# Altium schematic sheet PROB_S7CAS_INTERFACE.SchDoc
size Tabloid; SheetNumber: 8; SheetTotal: 15; Sheet_Name: Interface Utilisateur FPGA; Size: 11x17
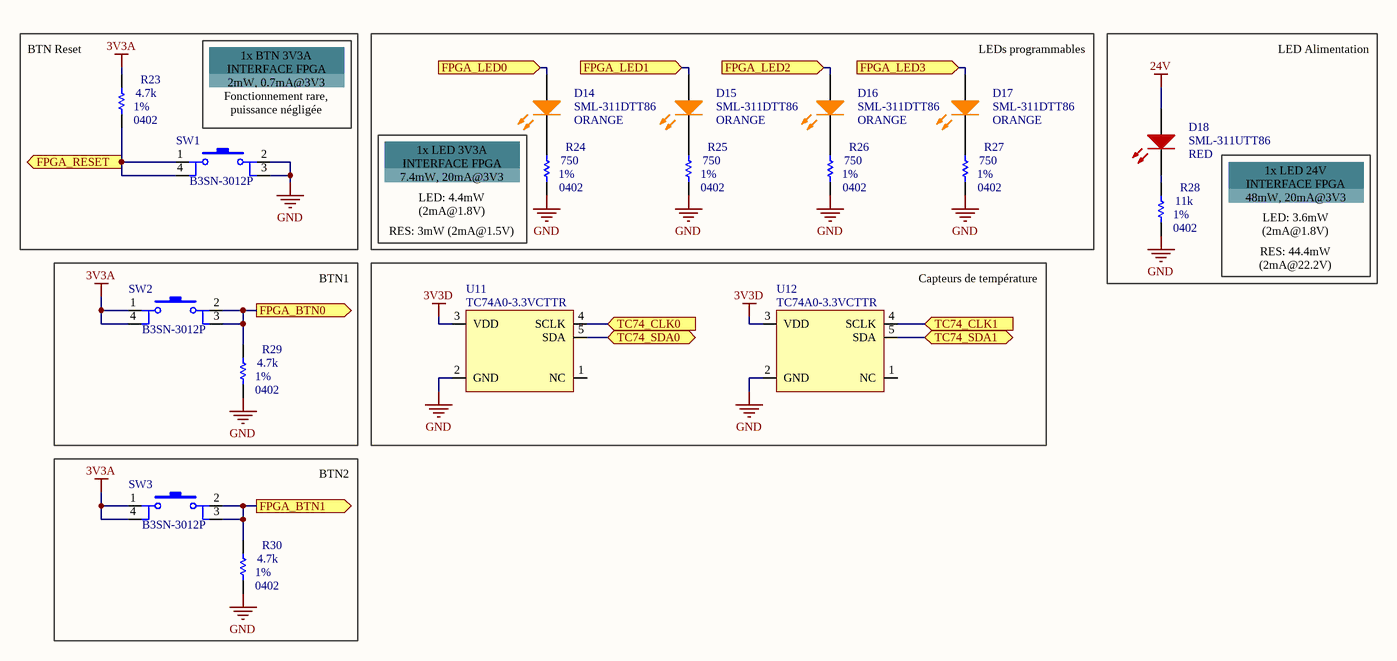
[diagram p0: PROB_S7CAS_INTERFACE.SchDoc]

## Parts
D14  SML-311DTT86  value ORANGE  [LED_0603]
D15  SML-311DTT86  value ORANGE  [LED_0603]
D16  SML-311DTT86  value ORANGE  [LED_0603]
D17  SML-311DTT86  value ORANGE  [LED_0603]
D18  SML-311UTT86  value RED  [LED_0603]
R23  value 4.7k  Package: 0402  Precision: 1%  [RES_0402]  (hidden comment: RES - 0402)
R24  value 750  Package: 0402  Precision: 1%  [RES_0402]  (hidden comment: RES - 0402)
R25  value 750  Package: 0402  Precision: 1%  [RES_0402]  (hidden comment: RES - 0402)
R26  value 750  Package: 0402  Precision: 1%  [RES_0402]  (hidden comment: RES - 0402)
R27  value 750  Package: 0402  Precision: 1%  [RES_0402]  (hidden comment: RES - 0402)
R28  value 11k  Package: 0402  Precision: 1%  [RES_0402]  (hidden comment: RES - 0402)
R29  value 4.7k  Package: 0402  Precision: 1%  [RES_0402]  (hidden comment: RES - 0402)
R30  value 4.7k  Package: 0402  Precision: 1%  [RES_0402]  (hidden comment: RES - 0402)
SW1  B3SN-3012P  [SWI_TACT_B3SN-3012P]
SW2  B3SN-3012P  [SWI_TACT_B3SN-3012P]
SW3  B3SN-3012P  [SWI_TACT_B3SN-3012P]
U11  TC74A0-3.3VCTTR  [SEN_TEMP_TC74A0-3.3VCTTR]
U12  TC74A0-3.3VCTTR  [SEN_TEMP_TC74A0-3.3VCTTR]

## Ports
FPGA_BTN0 (out), FPGA_BTN1 (out), FPGA_LED0 (in), FPGA_LED1 (in), FPGA_LED2 (in), FPGA_LED3 (in), FPGA_RESET (out), TC74_CLK0 (in), TC74_CLK1 (in), TC74_SDA0 (bidir), TC74_SDA1 (bidir)

## Nets
3V3A: R23.2 SW2.1 SW2.4 SW3.1 SW3.4
3V3D: U11.3(VDD) U12.3(VDD)
24V: D18.A
GND: R24.1 R25.1 R26.1 R27.1 R28.1 R29.1 R30.1 SW1.2 SW1.3 U11.2(GND) U12.2(GND)
FPGA_BTN0: R29.2 SW2.2 SW2.3 ; port FPGA_BTN0
FPGA_BTN1: R30.2 SW3.2 SW3.3 ; port FPGA_BTN1
FPGA_LED0: D14.A ; port FPGA_LED0
FPGA_LED1: D15.A ; port FPGA_LED1
FPGA_LED2: D16.A ; port FPGA_LED2
FPGA_LED3: D17.A ; port FPGA_LED3
FPGA_RESET: R23.1 SW1.1 SW1.4 ; port FPGA_RESET
TC74_CLK0: U11.4(SCLK) ; port TC74_CLK0
TC74_CLK1: U12.4(SCLK) ; port TC74_CLK1
TC74_SDA0: U11.5(SDA) ; port TC74_SDA0
TC74_SDA1: U12.5(SDA) ; port TC74_SDA1
NetD14_K: D14.K R24.2
NetD15_K: D15.K R25.2
NetD16_K: D16.K R26.2
NetD17_K: D17.K R27.2
NetD18_K: D18.K R28.2

Not connected (* = marked no-connect by the designer): U11 1(NC); U12 1(NC)

## Notes on the sheet
- (near R23) BTN Reset
- 1x BTN 3V3A
- INTERFACE FPGA
- 2mW, 0.7mA@3V3
- (near D17) LEDs programmables
- LED Alimentation
- (near SW1) Fonctionnement rare, puissance négligée
- 1x LED 3V3A
- (near R24) INTERFACE FPGA
- (near R24) 7.4mW, 20mA@3V3
- (near R24) LED: 4.4mW (2mA@1.8V)
- (near R24) RES: 3mW (2mA@1.5V)
- 1x LED 24V
- 48mW, 20mA@3V3
- LED: 3.6mW (2mA@1.8V)
- (near SW2) BTN1
- (near U12) Capteurs de température
- RES: 44.4mW (2mA@22.2V)
- (near SW3) BTN2
- Sheet Name
- Project Title
- Global Project
- Size
- Group
- Revision
- Date
- Sheet
- of
- Filename
- Designers

## Library data of the parts
D14-D17 = LED_SML-311DTT86: LED - 611nM ORANGE 2mA - 0603; Voltage: 1.8V; Mfg: ROHM Semiconductor; Power: 44mW; Current: 2mA; HelpURL: http://media.digikey.com/pdf/Data%20Sheets/Rohm%20PDFs/SML-311%20Series.pdf; CreatedBy: Jonathan Bouchard; Temperature: -40°C to 85°C; Package: 0603; Precision: *; Mfg Part Number: SML-311DTT86; Supplier 1: Digikey; Supplier Part Number 1: 511-1303-1-ND
D18 = LED_SML-311UTT86: LED - 620nM RED 2mA - 0603; Voltage: 1.8V; Mfg: ROHM Semiconductor; Power: 44mW; Current: 2mA; HelpURL: http://media.digikey.com/pdf/Data%20Sheets/Rohm%20PDFs/SML-311%20Series.pdf; CreatedBy: Jonathan Bouchard; Temperature: -30°C to 85°C; Package: 0603; Precision: *; Mfg Part Number: SML-311UTT86; Supplier 1: Digikey; Supplier Part Number 1: 511-1304-1-ND
R23-R30 = RES - 0402: Voltage: 50V; Power: 1/16W; Current: *; CreatedBy: Jonathan Bouchard
SW1-SW3 = SWI_TACT_B3SN-3012P: SWI - TACT SPST-NO 0.05A 24V - 4-SMD; Current: 50mA; Mfg: Omron; Mfg Part Number: B3SN-3012P; HelpURL: http://www.omron.com/ecb/products/pdf/en-b3sn.pdf; CreatedBy: Jonathan Bouchard; Temperature: -25°C ~ 70°C; Power: *; Precision: *; Package: 4-SMD; Value: *; Voltage: 24V; Supplier 1: Digikey; Supplier Part Number 1: SW261CT-ND
U11 U12 = SENS_TEMP_TC74A0-3.3VCTTR: SENS - TEMPERATURE SENSOR I2C/SMBUS - SOT23-5; Voltage: 2.7 V ~ 5.5 V; Mfg: Microchip; Precision: ±2°C (±3°C); Current: *; Power: *; Mfg Part Number: TC74A0-3.3VCTTR; HelpURL: http://ww1.microchip.com/downloads/en/DeviceDoc/21462D.pdf; CreatedBy: Jonathan Bouchard; Temperature: -40°C ~ 125°C; Value: *; Package: SOT23-5; Supplier 1: Digikey; Supplier Part Number 1: TC74A0-3.3VCTDKR-ND